# EAGLE design V1_milled fingers (EAGLE 9.6.2)
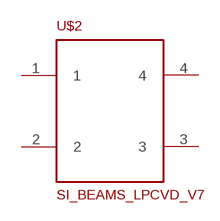
[diagram p0: schematic, sheet 1]

## Parts
U$2  SI_BEAMS_LPCVD_V7  [SI_BEAMS_LPCVD_V7]
Unconnected: U$2.1 U$2.2 U$2.3 U$2.4

## Library data of the parts
U$2 = nanomade:SI_BEAMS_LPCVD_V7

## Board
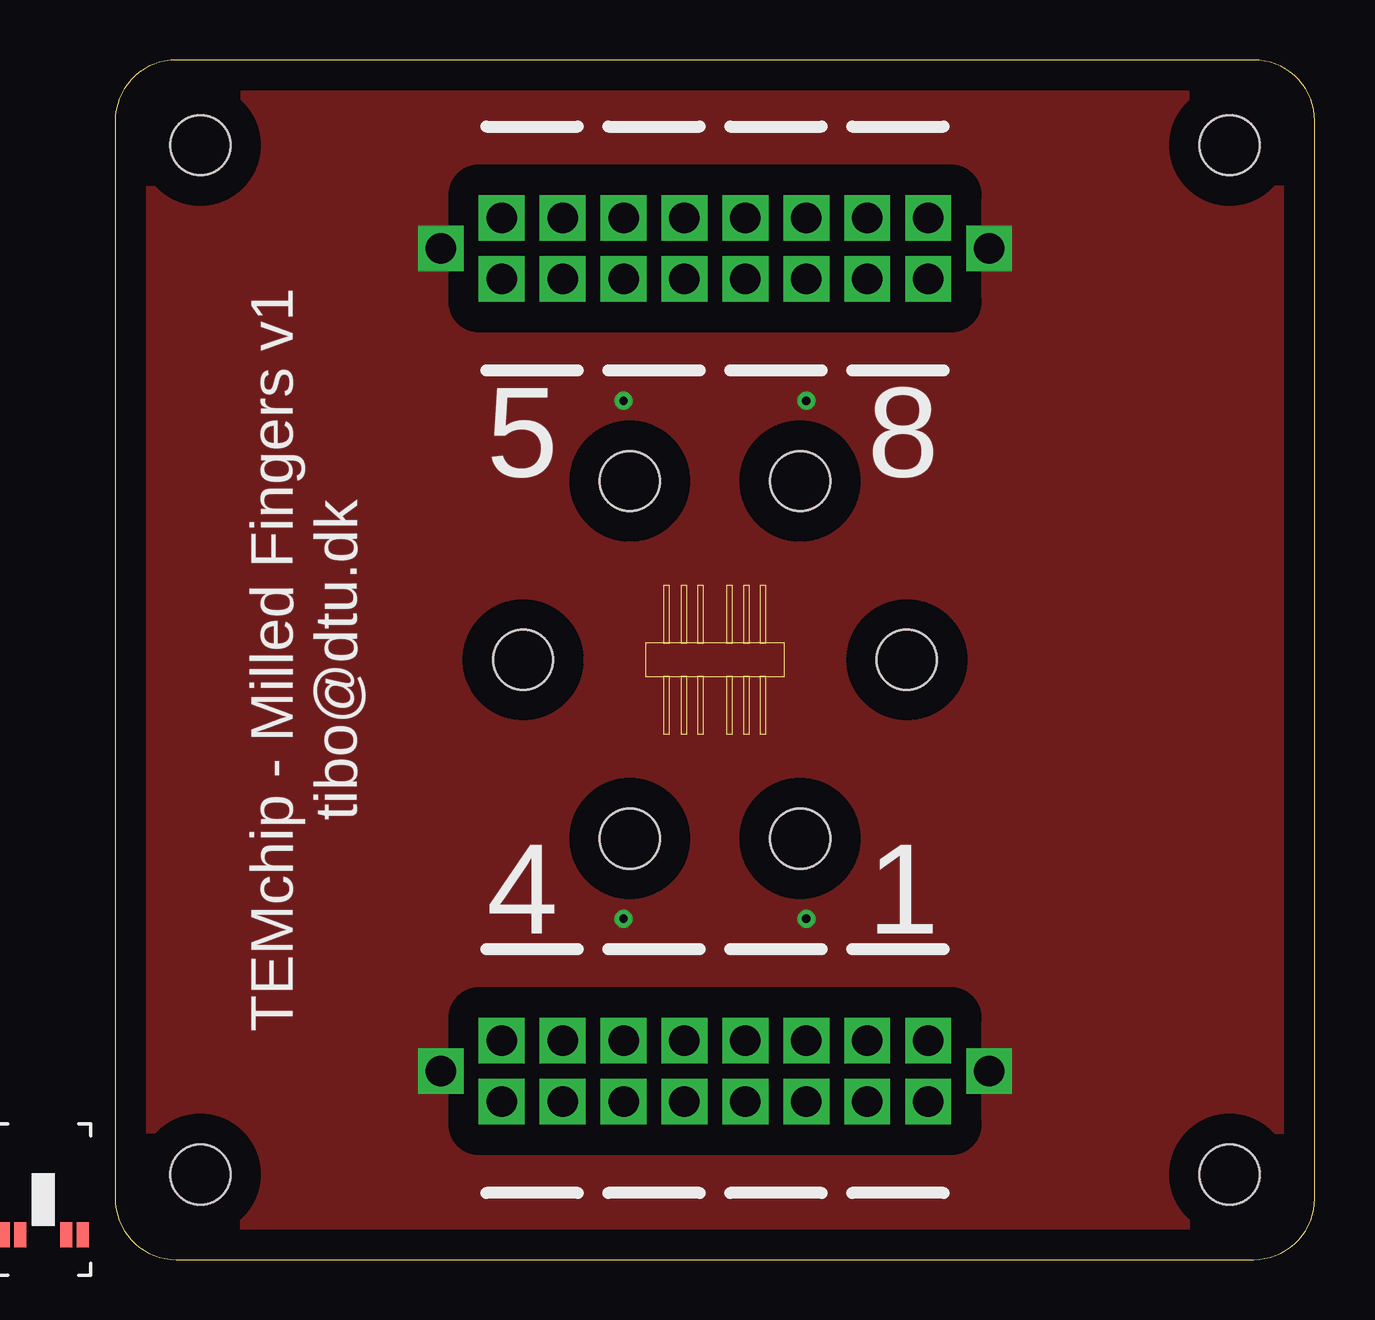
[diagram p1: board, top side]
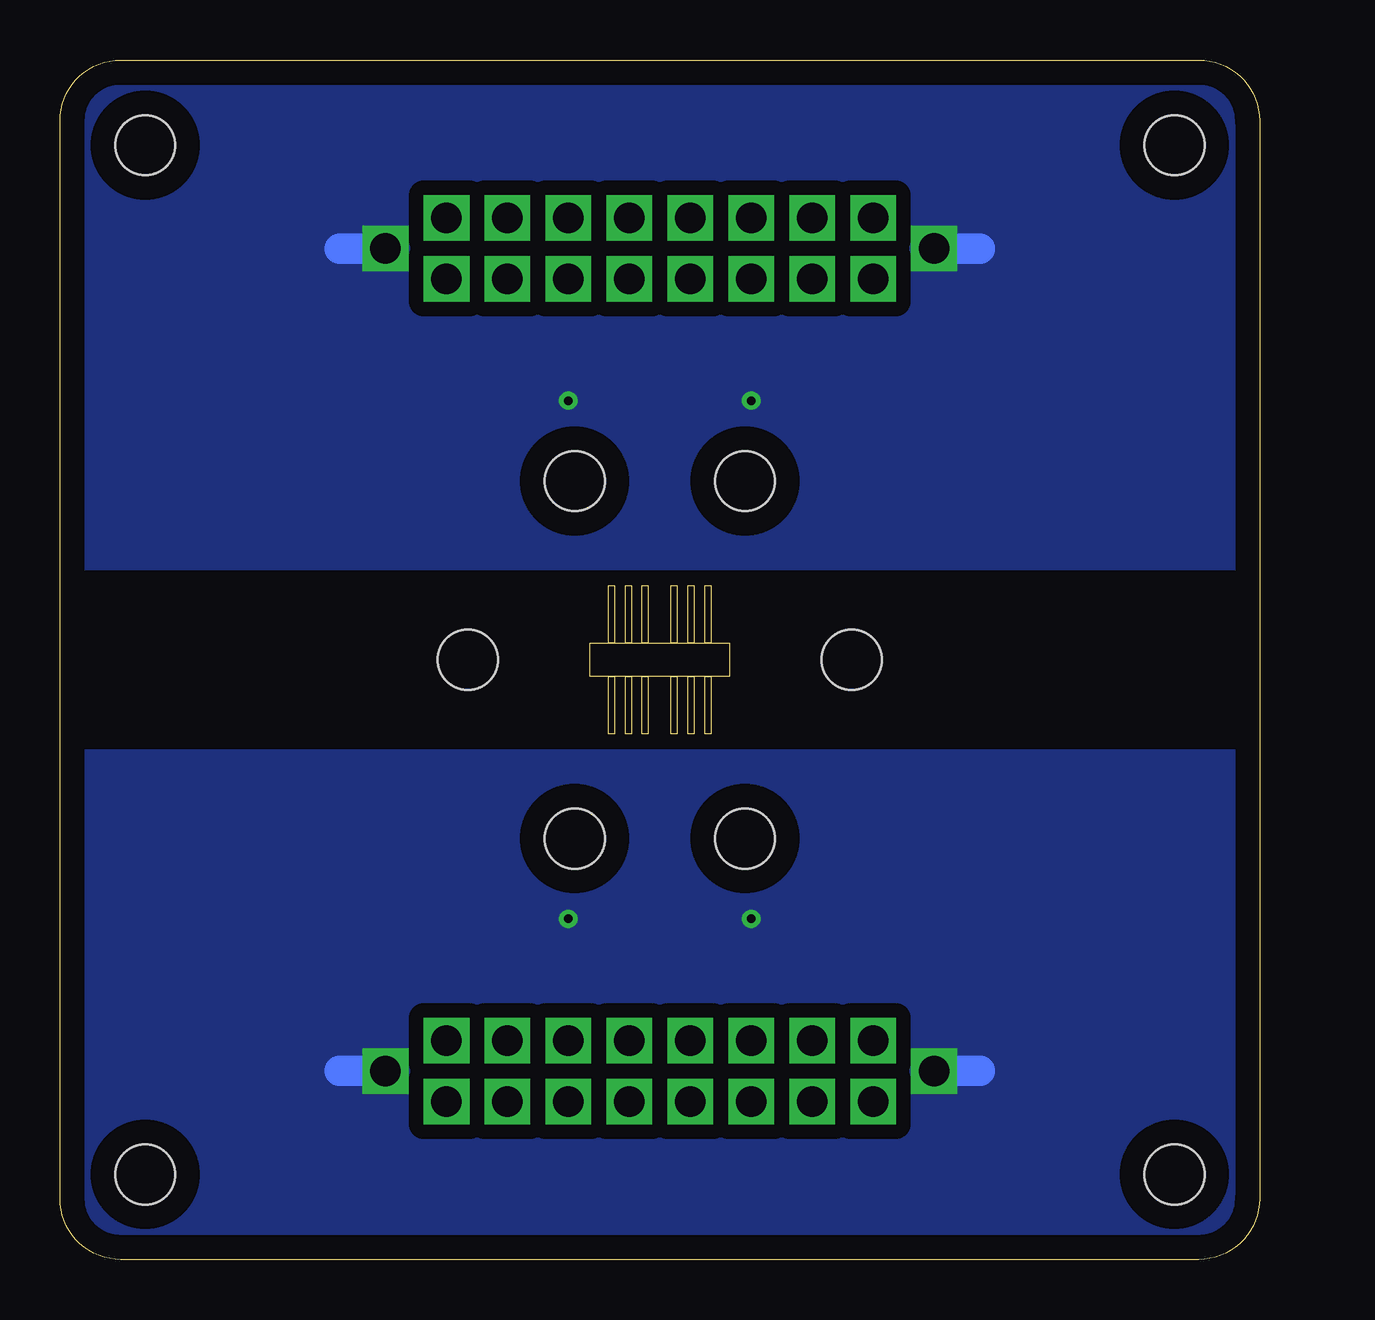
[diagram p2: board, bottom side, seen from below]

Size 50 x 50 mm. Coordinates in mm from the lower left corner, seen from the top.
Outline: 0,47.46 0,2.54 arc90 2.54,0 47.46,0 arc90 50,2.54 50,47.46 arc90 47.46,50 2.54,50 arc90 0,47.46
Copper layers (1*16): Top 0.035mm / dielectric 1.5mm / Bottom 0.035mm
Design rules "default": minimum track width 6mil, minimum drill 0.35mm, track to track 6mil, track to pad 6mil, pad to pad 6mil, via to via 6mil, smd to smd 6mil, copper to edge 40mil, drill to drill 6mil, minimum pad ring 10mil, minimum via ring 8mil, stop-mask expansion 4mil, vias tented up to drill 0mil, thermal gap 10mil
Holes 2.5 mm at 3.55,46.45 46.45,46.45 46.45,3.55 3.55,3.55 17,25 33,25 28.55,32.45 21.45,32.45 28.55,17.55 21.45,17.55
Milling: area 24.3,21.9 to 24.5,24.3; area 23.6,21.9 to 23.8,24.3; area 22.9,21.9 to 23.1,24.3; area 23.6,25.7 to 23.8,28.1; area 22.9,25.7 to 23.1,28.1; area 26.2,25.7 to 26.4,28.1; area 26.9,25.7 to 27.1,28.1; area 26.2,21.9 to 26.4,24.3; area 25.5,21.9 to 25.7,24.3; area 25.5,25.7 to 25.7,28.1; area 26.9,21.9 to 27.1,24.3; area 22.1,24.3 to 27.9,25.7; 3 more areas

### Footprints (pad centres in the part's own frame; a part is rotated, then mirrored left to right if it is on the bottom)
SI_BEAMS_LPCVD_V7 = smd 0.5 x 1.05: 1 -1.65,-1.47; 2 -0.95,-1.47; 3 0.95,-1.47; 4 1.65,-1.47

### Placement (x,y rotation side)
U$2  -3,2.5 0 top

### Tracks (layer width: path | path; a pad name or v marks a point on that pad's centre or on a via)
N$17  (via drill 1.27)
  other vias: 16.11,9.12
N$18  (via drill 1.27)
  other vias: 18.65,9.12
N$19  (via drill 1.27)
  other vias: 21.19,9.12
N$20  (via drill 1.27)
  other vias: 23.73,9.12
N$21  (via drill 1.27)
  other vias: 26.27,9.12
N$22  (via drill 1.27)
  other vias: 28.81,9.12
N$23  (via drill 1.27)
  other vias: 31.35,9.12
N$24  (via drill 1.27)
  other vias: 33.89,9.12
N$25  (via drill 1.27)
  other vias: 33.89,6.59
N$26  (via drill 1.27)
  other vias: 31.35,6.59
N$27  (via drill 1.27)
  other vias: 28.81,6.59
N$28  (via drill 1.27)
  other vias: 26.27,6.59
N$29  (via drill 1.27)
  other vias: 23.73,6.59
N$30  (via drill 1.27)
  other vias: 21.19,6.59
N$31  (via drill 1.27)
  other vias: 18.65,6.59
N$32  (via drill 1.27)
  other vias: 16.11,6.59
N$33  (via drill 1.27)
  other vias: 16.11,40.88
N$34  (via drill 1.27)
  other vias: 18.65,40.88
N$35  (via drill 1.27)
  other vias: 21.19,40.88
N$36  (via drill 1.27)
  other vias: 23.73,40.88
N$37  (via drill 1.27)
  other vias: 26.27,40.88
N$38  (via drill 1.27)
  other vias: 28.81,40.88
N$39  (via drill 1.27)
  other vias: 31.35,40.88
N$40  (via drill 1.27)
  other vias: 33.89,40.88
N$41  (via drill 1.27)
  other vias: 33.89,43.41
N$42  (via drill 1.27)
  other vias: 31.35,43.41
N$43  (via drill 1.27)
  other vias: 28.81,43.41
N$44  (via drill 1.27)
  other vias: 26.27,43.41
N$45  (via drill 1.27)
  other vias: 23.73,43.41
N$46  (via drill 1.27)
  other vias: 21.19,43.41
N$47  (via drill 1.27)
  other vias: 18.65,43.41
N$48  (via drill 1.27)
  other vias: 16.11,43.41
PLANE  (via drill 0.35, 1.27)
  Bottom 1.27: v13.57,7.86 11.66,7.86 | v36.43,7.86 38.34,7.86 | v36.43,42.14 38.34,42.14 | v13.57,42.14 11.66,42.14
  other vias: 21.19,14.21 28.81,14.21 28.81,35.8 21.19,35.8
  pour Bottom (isolate 0.61): -0.4,-0.4 -0.4,21.19 50.4,21.19 50.4,-0.4
  pour Bottom (isolate 0.61): -0.4,28.81 -0.4,50.4 50.4,50.4 50.4,28.81
  pour Top (isolate 1.27): -0.4,50.4 50.4,50.4 50.4,-0.4 -0.4,-0.4

### Text on the board
tPlace: 5 | 8 | TEMchip - Milled Fingers v1 / tibo@dtu.dk | 4 | 1